# EasyEDA schematic SCH_Macropad_2023-10-24.json
TITLE: Schematic_Macropad; REV: 1.0; Date: 2023-10-24; Sheet: 1/1; Drawn By: Zacky Albandar; Company: Wissahickon High School
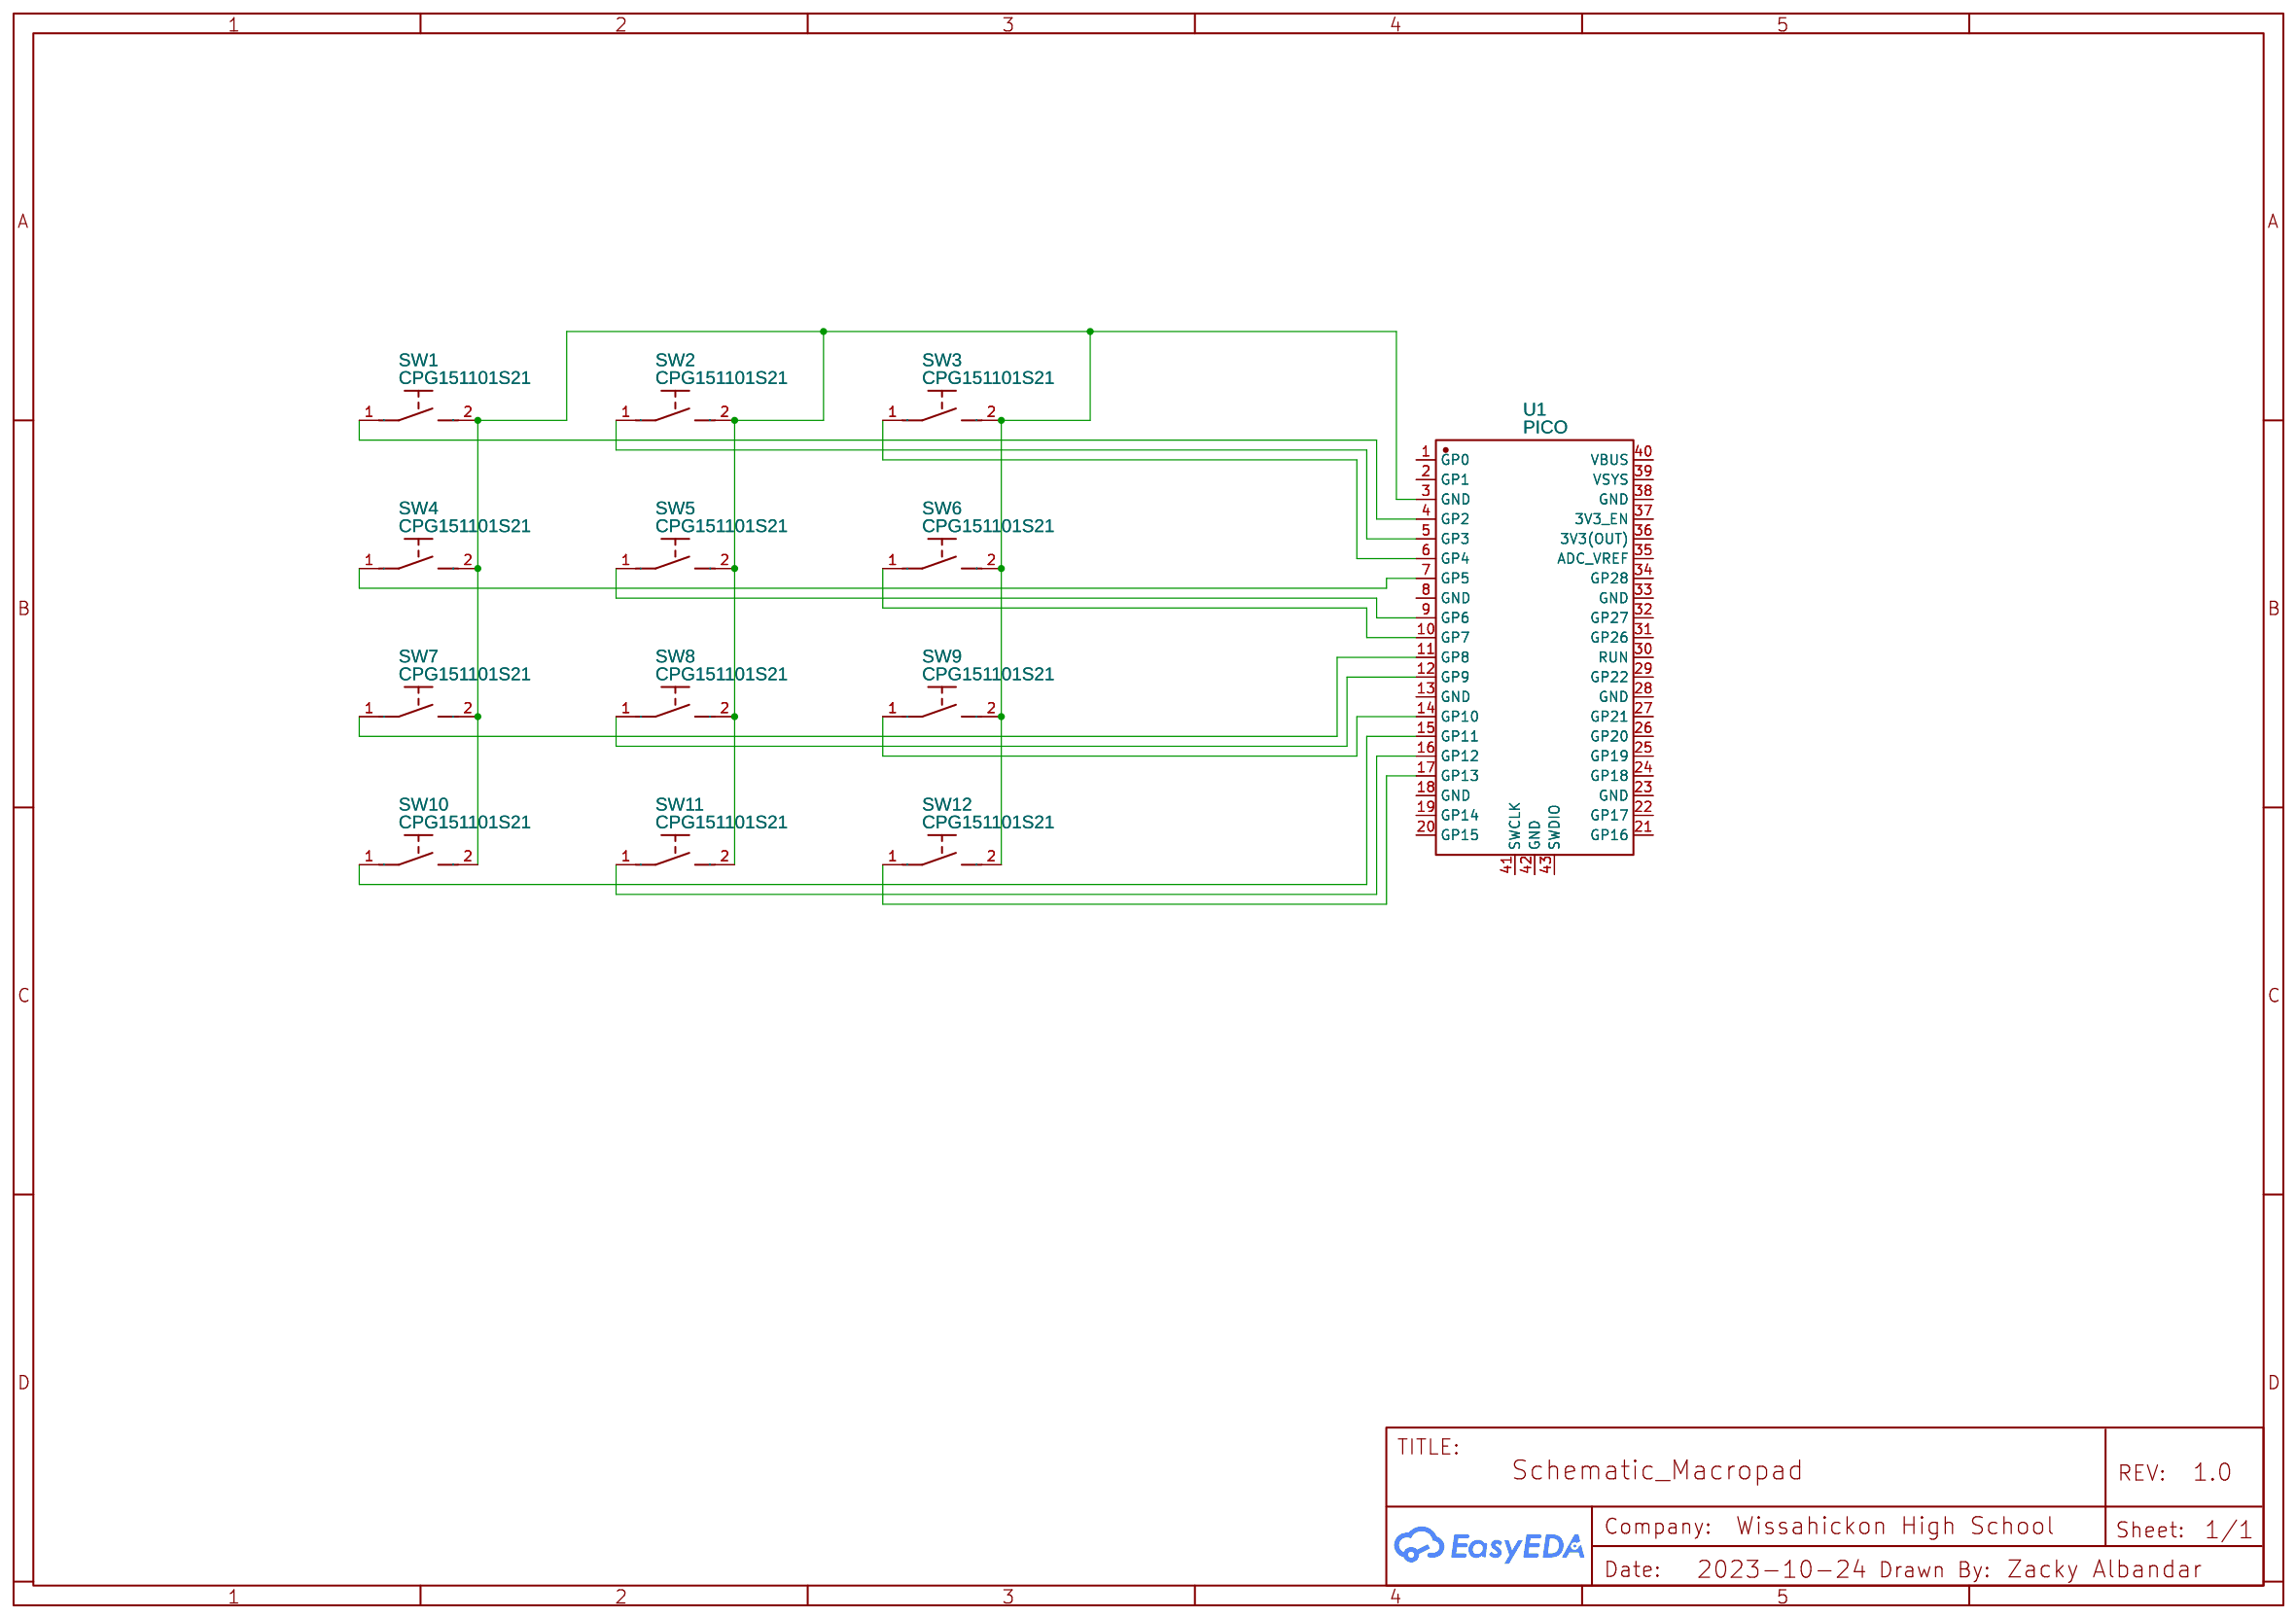
[diagram p0: schematic sheet]

## Parts
SW1  CPG151101S21  [KEY-TH_CPG1511F01S0X]
SW2  CPG151101S21  [KEY-TH_CPG1511F01S0X]
SW3  CPG151101S21  [KEY-TH_CPG1511F01S0X]
SW4  CPG151101S21  [KEY-TH_CPG1511F01S0X]
SW5  CPG151101S21  [KEY-TH_CPG1511F01S0X]
SW6  CPG151101S21  [KEY-TH_CPG1511F01S0X]
SW7  CPG151101S21  [KEY-TH_CPG1511F01S0X]
SW8  CPG151101S21  [KEY-TH_CPG1511F01S0X]
SW9  CPG151101S21  [KEY-TH_CPG1511F01S0X]
SW10  CPG151101S21  [KEY-TH_CPG1511F01S0X]
SW11  CPG151101S21  [KEY-TH_CPG1511F01S0X]
SW12  CPG151101S21  [KEY-TH_CPG1511F01S0X]
U1  PICO  [COMM-SMD_L51.0-W21.0-P2.54_SC0916]

## Library data of the parts
SW1-SW12 = CPG151101S21: Contributor: LCSC; Supplier: LCSC; Supplier Part: C404351; Manufacturer: Kailh(凯华); JLCPCB Part Class: Extended Part; link: https://lcsc.com/eda_search?q=C404351&%26type=1&ref=editor
U1 = PICO: Supplier: LCSC; Supplier Part: C7203002; Manufacturer: Raspberry Pi(树莓派); JLCPCB Part Class: Extended Part; Contributor: lcsc; link: https://lcsc.com/eda_search?q=C7203002&%26type=1&ref=editor

## Nets
Net-(SW1-1): SW1.1 U1.4(GP2)
Net-(SW1-2): SW1.2 SW2.2 SW3.2 SW4.2 SW5.2 SW6.2 SW7.2 SW8.2 SW9.2 SW10.2 SW11.2 SW12.2 U1.3(GND)
Net-(SW2-1): SW2.1 U1.5(GP3)
Net-(SW3-1): SW3.1 U1.6(GP4)
Net-(SW4-1): SW4.1 U1.7(GP5)
Net-(SW5-1): SW5.1 U1.9(GP6)
Net-(SW6-1): SW6.1 U1.10(GP7)
Net-(SW7-1): SW7.1 U1.11(GP8)
Net-(SW8-1): SW8.1 U1.12(GP9)
Net-(SW9-1): SW9.1 U1.14(GP10)
Net-(SW10-1): SW10.1 U1.15(GP11)
Net-(SW11-1): SW11.1 U1.16(GP12)
Net-(SW12-1): SW12.1 U1.17(GP13)

Not connected (* = marked no-connect by the designer): U1 1(GP0) 2(GP1) 8(GND) 13(GND) 18(GND) 19(GP14) 20(GP15) 21(GP16) 22(GP17) 23(GND) 24(GP18) 25(GP19) 26(GP20) 27(GP21) 28(GND) 29(GP22) 30(RUN) 31(GP26) 32(GP27) 33(GND) 34(GP28) 35(ADC_VREF) 36(3V3(OUT)) 37(3V3_EN) 38(GND) 39(VSYS) 40(VBUS) 41(SWCLK) 42(GND) 43(SWDIO)
